# Altium project LPC1769test.PrjPcb
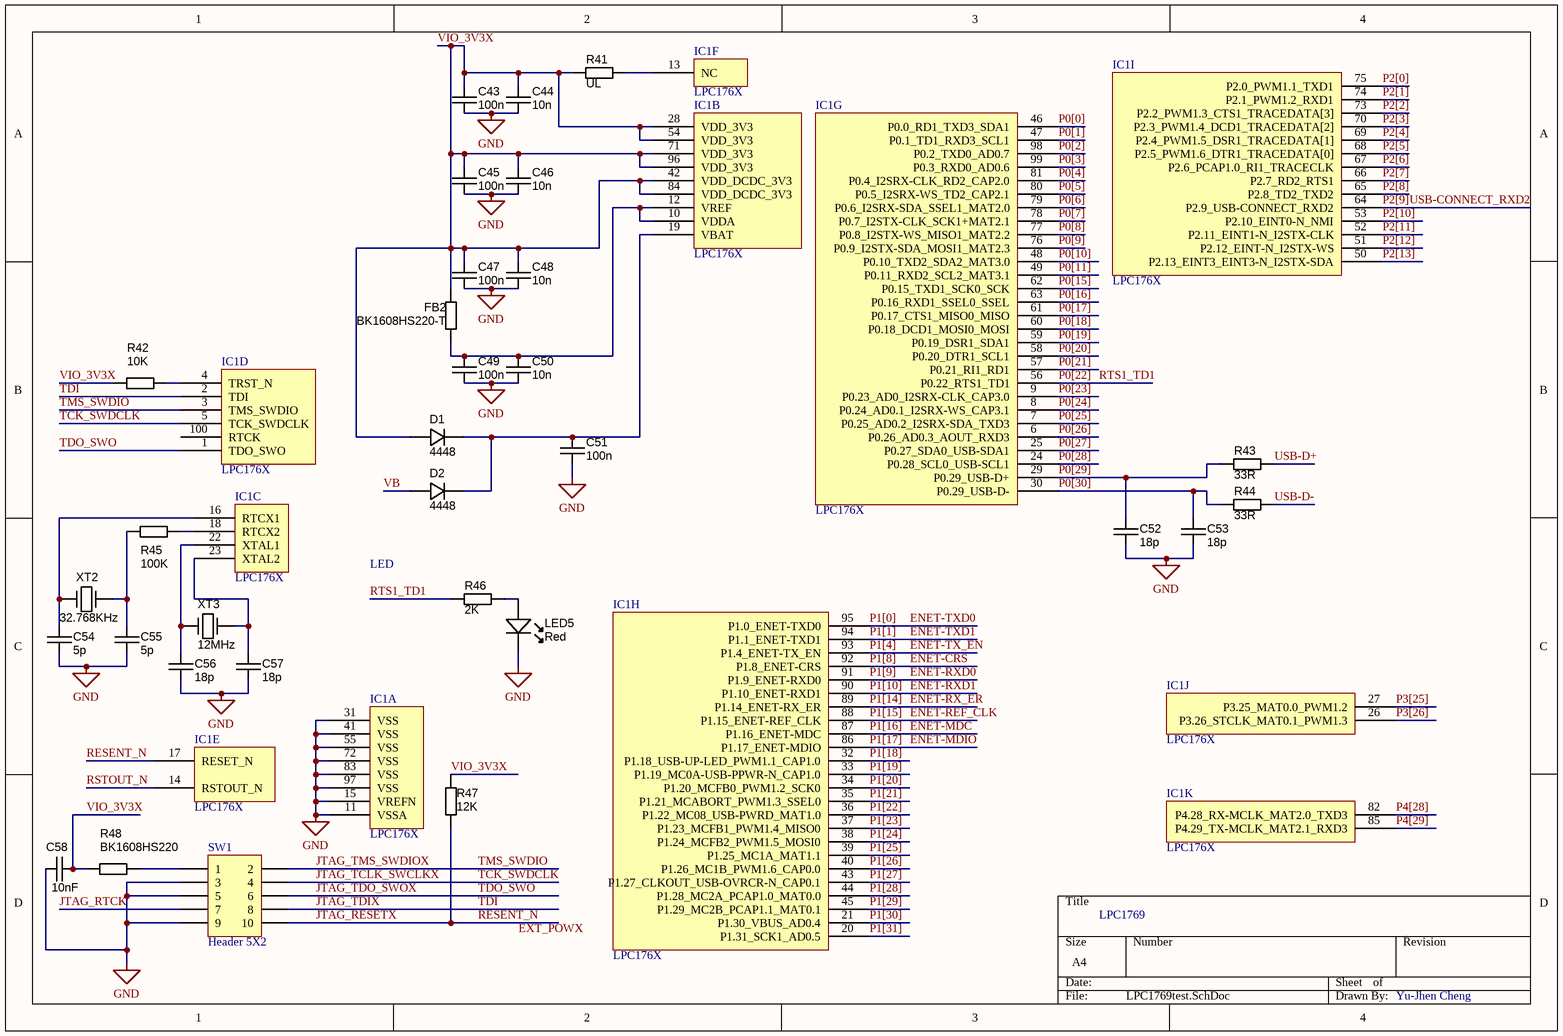
[diagram p0: LPC1769test.SchDoc]
1 sheet, 32 parts. Net scope: global (net labels, ports and power ports of the same name join across sheets).
Board file: LPC1769test.PcbDoc

## Sheet LPC1769test.SchDoc
size A4

### Parts
C43  value 100n  [CAPC2012N]  (hidden comment: approved sub OK)
C44  value 10n  [CAPC2012N]  (hidden comment: approved sub OK)
C45  value 100n  [CAPC2012N]  (hidden comment: approved sub OK)
C46  value 10n  [CAPC2012N]  (hidden comment: approved sub OK)
C47  value 100n  [CAPC2012N]  (hidden comment: approved sub OK)
C48  value 10n  [CAPC2012N]  (hidden comment: approved sub OK)
C49  value 100n  [CAPC2012N]  (hidden comment: approved sub OK)
C50  value 10n  [CAPC2012N]  (hidden comment: approved sub OK)
C51  value 100n  [CAPC2012N]  (hidden comment: approved sub OK)
C52  value 18p  [CAPC2012N]  (hidden comment: approved sub OK)
C53  value 18p  [CAPC2012N]  (hidden comment: approved sub OK)
C54  value 5p  [CAPC2012N]  (hidden comment: approved sub OK)
C55  value 5p  [CAPC2012N]  (hidden comment: approved sub OK)
C56  value 18p  [CAPC2012N]  (hidden comment: approved sub OK)
C57  value 18p  [CAPC2012N]  (hidden comment: approved sub OK)
C58  value 10nF  [CAPC2012N]  (hidden comment: approved sub OK)
D1  4448  [SOD523F]
D2  4448  [SOD523F]
FB2  value BK1608HS220-T  [RESC2012N]  (hidden comment: Thick Film)
IC1  LPC176X  [TQFP-PT100_N]  (parts A,B,C,D,E,F,G,H,I,J,K of 11)
LED5  Red  [LED-0805-A]
R41  value UL  [RESC2012N]  (hidden comment: Thick Film)
R42  value 10K  [RESC1005N]  (hidden comment: Thick Film)
R43  value 33R  [RESC2012N]  (hidden comment: Thick Film)
R44  value 33R  [RESC2012N]  (hidden comment: Thick Film)
R45  value 100K  [RESC2012N]  (hidden comment: Thick Film)
R46  value 2K  [RESC2012N]  (hidden comment: Thick Film)
R47  value 12K  [RESC1005N]  (hidden comment: Thick Film)
R48  value BK1608HS220  [RESC2012N]  (hidden comment: Thick Film)
SW1  Header 5X2  [HDR2X5]
XT2  32.768KHz  [CRYSTAL_HC49-US-SM]
XT3  12MHz  [CRYSTAL_HC49-US-SM]

### Nets
GND: C43.1 C44.1 C45.1 C46.1 C47.1 C48.1 C49.1 C50.1 C51.1 C52.1 C53.1 C54.1 C55.1 C56.1 C57.1 C58.1 IC1.11(VSSA) IC1.15(VREFN) IC1.31(VSS) IC1.41(VSS) IC1.55(VSS) IC1.72(VSS) IC1.83(VSS) IC1.97(VSS) LED5.K SW1.3 SW1.5 SW1.9
ENET-CRS: IC1.92(P1.8_ENET-CRS)  [also labelled P1[8]]
ENET-MDC: IC1.87(P1.16_ENET-MDC)  [also labelled P1[16]]
ENET-MDIO: IC1.86(P1.17_ENET-MDIO)  [also labelled P1[17]]
ENET-REF_CLK: IC1.88(P1.15_ENET-REF_CLK)  [also labelled P1[15]]
ENET-RX_ER: IC1.89(P1.14_ENET-RX_ER)  [also labelled P1[14]]
ENET-RXD0: IC1.91(P1.9_ENET-RXD0)  [also labelled P1[9]]
ENET-RXD1: IC1.90(P1.10_ENET-RXD1)  [also labelled P1[10]]
ENET-TX_EN: IC1.93(P1.4_ENET-TX_EN)  [also labelled P1[4]]
ENET-TXD0: IC1.95(P1.0_ENET-TXD0)  [also labelled P1[0]]
ENET-TXD1: IC1.94(P1.1_ENET-TXD1)  [also labelled P1[1]]
JTAG_RESETX: IC1.17(RESET_N) R47.1 SW1.10  [also labelled RESENT_N]
JTAG_RTCK: SW1.7
JTAG_TCLK_SWCLKX: IC1.5(TCK_SWDCLK) SW1.4  [also labelled TCK_SWDCLK]
JTAG_TDIX: IC1.2(TDI) SW1.8  [also labelled TDI]
JTAG_TDO_SWOX: IC1.1(TDO_SWO) SW1.6  [also labelled TDO_SWO]
JTAG_TMS_SWDIOX: IC1.3(TMS_SWDIO) SW1.2  [also labelled TMS_SWDIO]
P0[0]: IC1.46(P0.0_RD1_TXD3_SDA1)
P0[1]: IC1.47(P0.1_TD1_RXD3_SCL1)
P0[2]: IC1.98(P0.2_TXD0_AD0.7)
P0[3]: IC1.99(P0.3_RXD0_AD0.6)
P0[4]: IC1.81(P0.4_I2SRX-CLK_RD2_CAP2.0)
P0[5]: IC1.80(P0.5_I2SRX-WS_TD2_CAP2.1)
P0[6]: IC1.79(P0.6_I2SRX-SDA_SSEL1_MAT2.0)
P0[7]: IC1.78(P0.7_I2STX-CLK_SCK1+MAT2.1)
P0[8]: IC1.77(P0.8_I2STX-WS_MISO1_MAT2.2)
P0[9]: IC1.76(P0.9_I2STX-SDA_MOSI1_MAT2.3)
P0[10]: IC1.48(P0.10_TXD2_SDA2_MAT3.0)
P0[11]: IC1.49(P0.11_RXD2_SCL2_MAT3.1)
P0[15]: IC1.62(P0.15_TXD1_SCK0_SCK)
P0[16]: IC1.63(P0.16_RXD1_SSEL0_SSEL)
P0[17]: IC1.61(P0.17_CTS1_MISO0_MISO)
P0[18]: IC1.60(P0.18_DCD1_MOSI0_MOSI)
P0[19]: IC1.59(P0.19_DSR1_SDA1)
P0[20]: IC1.58(P0.20_DTR1_SCL1)
P0[21]: IC1.57(P0.21_RI1_RD1)
P0[22]: IC1.56(P0.22_RTS1_TD1) R46.1  [also labelled RTS1_TD1]
P0[23]: IC1.9(P0.23_AD0_I2SRX-CLK_CAP3.0)
P0[24]: IC1.8(P0.24_AD0.1_I2SRX-WS_CAP3.1)
P0[25]: IC1.7(P0.25_AD0.2_I2SRX-SDA_TXD3)
P0[26]: IC1.6(P0.26_AD0.3_AOUT_RXD3)
P0[27]: IC1.25(P0.27_SDA0_USB-SDA1)
P0[28]: IC1.24(P0.28_SCL0_USB-SCL1)
P0[29]: C52.2 IC1.29(P0.29_USB-D+) R43.2
P0[30]: C53.2 IC1.30(P0.29_USB-D-) R44.2
P1[18]: IC1.32(P1.18_USB-UP-LED_PWM1.1_CAP1.0)
P1[19]: IC1.33(P1.19_MC0A-USB-PPWR-N_CAP1.0)
P1[20]: IC1.34(P1.20_MCFB0_PWM1.2_SCK0)
P1[21]: IC1.35(P1.21_MCABORT_PWM1.3_SSEL0)
P1[22]: IC1.36(P1.22_MC08_USB-PWRD_MAT1.0)
P1[23]: IC1.37(P1.23_MCFB1_PWM1.4_MISO0)
P1[24]: IC1.38(P1.24_MCFB2_PWM1.5_MOSI0)
P1[25]: IC1.39(P1.25_MC1A_MAT1.1)
P1[26]: IC1.40(P1.26_MC1B_PWM1.6_CAP0.0)
P1[27]: IC1.43(P1.27_CLKOUT_USB-OVRCR-N_CAP0.1)
P1[28]: IC1.44(P1.28_MC2A_PCAP1.0_MAT0.0)
P1[29]: IC1.45(P1.29_MC2B_PCAP1.1_MAT0.1)
P1[30]: IC1.21(P1.30_VBUS_AD0.4)
P1[31]: IC1.20(P1.31_SCK1_AD0.5)
P2[0]: IC1.75(P2.0_PWM1.1_TXD1)
P2[1]: IC1.74(P2.1_PWM1.2_RXD1)
P2[2]: IC1.73(P2.2_PWM1.3_CTS1_TRACEDATA[3])
P2[3]: IC1.70(P2.3_PWM1.4_DCD1_TRACEDATA[2])
P2[4]: IC1.69(P2.4_PWM1.5_DSR1_TRACEDATA[1])
P2[5]: IC1.68(P2.5_PWM1.6_DTR1_TRACEDATA[0])
P2[6]: IC1.67(P2.6_PCAP1.0_RI1_TRACECLK)
P2[7]: IC1.66(P2.7_RD2_RTS1)
P2[8]: IC1.65(P2.8_TD2_TXD2)
P2[9]: IC1.64(P2.9_USB-CONNECT_RXD2)  [also labelled USB-CONNECT_RXD2]
P2[10]: IC1.53(P2.10_EINT0-N_NMI)
P2[11]: IC1.52(P2.11_EINT1-N_I2STX-CLK)
P2[12]: IC1.51(P2.12_EINT-N_I2STX-WS)
P2[13]: IC1.50(P2.13_EINT3_EINT3-N_I2STX-SDA)
P3[25]: IC1.27(P3.25_MAT0.0_PWM1.2)
P3[26]: IC1.26(P3.26_STCLK_MAT0.1_PWM1.3)
P4[28]: IC1.82(P4.28_RX-MCLK_MAT2.0_TXD3)
P4[29]: IC1.85(P4.29_TX-MCLK_MAT2.1_RXD3)
RSTOUT_N: IC1.14(RSTOUT_N)
USB-D+: R43.1
USB-D-: R44.1
VB: D2.A
VIO_3V3X: C43.2 C44.2 C45.2 C46.2 C47.2 C48.2 C58.2 D1.A FB2.2 IC1.28(VDD_3V3) IC1.42(VDD_DCDC_3V3) IC1.54(VDD_3V3) IC1.71(VDD_3V3) IC1.84(VDD_DCDC_3V3) IC1.96(VDD_3V3) R41.2 R42.1 R47.2 R48.2
NetC49_2: C49.2 C50.2 FB2.1 IC1.10(VDDA) IC1.12(VREF)
NetC51_2: C51.2 D1.K D2.K IC1.19(VBAT)
NetC54_2: C54.2 IC1.16(RTCX1) XT2.1(IN)
NetC55_2: C55.2 R45.2 XT2.2(OUT)
NetC56_2: C56.2 IC1.22(XTAL1) XT3.1(IN)
NetC57_2: C57.2 IC1.23(XTAL2) XT3.2(OUT)
NetIC1_4: IC1.4(TRST_N) R42.2
NetIC1_13: IC1.13(NC) R41.1
NetIC1_18: IC1.18(RTCX2) R45.1
NetLED5_A: LED5.A R46.2
NetR48_1: R48.1 SW1.1

Not connected (* = marked no-connect by the designer): IC1 100(RTCK)

### Notes on the sheet
- LED
- LPC1769
- Yu-Jhen Cheng
- Labels drawn without touching a wire or pin: EXT_POWX

### Library data of the parts
C43-C58 = CAPC_100n_0805: Capacitor SMD Cer 100nF 10% 50V X7R 0805; Manufacturer 1: Kemet; Manufacturer Part Number 1: C0805C104K5RACTU; Tolerance: ?0%; Ratings: 50V; X7R; Material: ceramic; Package / Case: 0805 (2012 metric); Supplier 1: Digi-Key; Supplier Part Number 1: 399-1170-1-ND
D1 D2 = DIODE_1N4148_200mA_SOD523F: Diode SMD small signal 0.2A SOD-523F; Ratings: Vr=75V; Vf=1V@10mA; Io=200mA; Material: Si; Package / Case: SC-79, SOD-523F; Supplier 1: Digi-Key; Supplier Part Number 1: 1N4148WTCT-ND; Value: 4448
FB2 R41 R43-R46 R48 = RES_10K_0805_5%: Resistor SMD chip 10k Ohm 0.125W 5% 0805; Manufacturer 1: Yageo; Manufacturer Part Number 1: RC0805JR-0710KL; Ratings: 1/8 W; Tolerance: ?%; Package / Case: 0805 (2012 metric); Material: Thick Film; Supplier 1: Digi-Key; Supplier Part Number 1: 311-10KARCT-ND
LED5 = LED_SMD_Red_0805: LED, 0805 SMD, Red; Manufacturer 1: Ligitek; Manufacturer Part Number 1: LG170SR-CT; Material: GaAIAs; Ratings: 20 mcd; 643 nm; Package / Case: 0805
R42 R47 = RES_330R_0402_5%: Resistor SMD chip 330 Ohm 0.063W 5% 0402; Manufacturer 1: Yageo; Manufacturer Part Number 1: RC0402JR-07330RL; Ratings: 1/16 W; Tolerance: ?%; Package / Case: 0402 (1005 Metric); Supplier 1: Digi-Key; Supplier Part Number 1: 311-330JRCT-ND; ComponentLink1URL: http://www.yageo.com/documents/recent/PYu-RC0402_51_RoHS_L_6.pdf; ComponentLink1Description: http://www.yageo.com/documents/recent/PYu-RC0402_51_RoHS_L_6.pdf
SW1 = Header 5X2: Header, 5-Pin, Dual row; LatestRevisionDate: 17-Jul-2002; LatestRevisionNote: Re-released for DXP Platform.; Publisher: Altium Limited
XT2 XT3 = Crystal_6MHz_HC49/US: Resonator Ceramic 6.00 MHz 30ppm; Manufacturer 1: CTS-Frequency Controls; Manufacturer Part Number 1: ATS060BSM-1; Frequency: 6MHz; Frequency Stability: ?0ppm; Load Capacitance: 18pF; Operating Mode: Fundamental; Parameter Name: 0.169" (4.30mm); Package / Case: HC49/US-SM; Ratings: 6.00 MHz; Supplier 1: Digi-Key; Supplier Part Number 1: CTX882CT-ND; Type: MHz Crystal; Frequency Tolerance: ?0ppm; Operating Temperat: -20°C ~ 70°C; Mounting Type: Surface Mount; Size / Dimension: 0.437" L x 0.190" W (11.10mm x 4.83mm); ComponentLink1URL: http://www.ctscorp.com/components/Datasheets/008-0309-0.pdf; ComponentLink1Description: http://www.ctscorp.com/components/Datasheets/008-0309-0.pdf